# EAGLE design soic8-longpad (EAGLE 7.7.0)
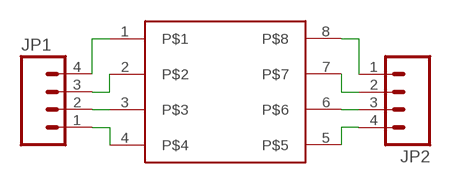
[diagram p0: schematic, sheet 1]

## Parts
JP1  M04NO_SILK_ALL_ROUND  [1X04_NO_SILK_ALL_ROUND]
JP2  M04NO_SILK_ALL_ROUND  [1X04_NO_SILK_ALL_ROUND]
U$1  SOIC8  SOIC8-LONGPAD  [SOIC8-LONGPAD]

## Nets
N$1: JP1.4 U$1.1
N$2: JP1.3 U$1.2
N$3: JP1.2 U$1.3
N$4: JP1.1 U$1.4
N$5: JP2.1 U$1.8
N$6: JP2.2 U$1.7
N$7: JP2.3 U$1.6
N$8: JP2.4 U$1.5

## Library data of the parts
JP1 JP2 = SparkFun-Connectors:M04: Header 4 Standard 4-pin 0.1" header. Use with straight break away headers (SKU : PRT-00116), right angle break away headers (PRT-00553), swiss pins (PRT-00743), machine pins (PRT-00117), and female headers (PRT-00115). Molex polarized connector foot print use with SKU : PRT-08231 with associated crimp pins and housings. 1MM SMD Version SKU: PRT-10208
U$1 = awqua_eagle_library:SOIC8-LONGPAD

## Board
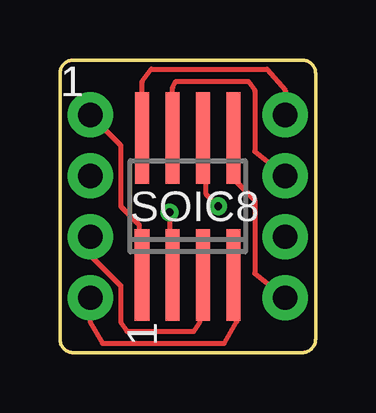
[diagram p1: board, top side]
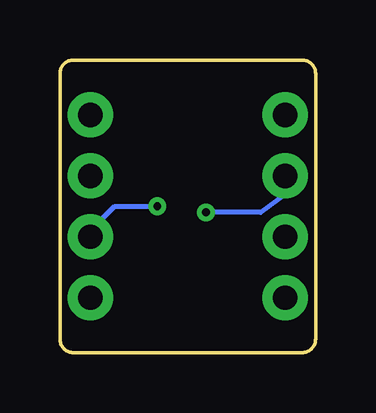
[diagram p2: board, bottom side, seen from below]

Size 10.67 x 12.19 mm. Coordinates in mm from the lower left corner, seen from the top.
Outline: 0,11.62 0,0.57 arc90 0.57,0 10.1,0 arc90 10.67,0.57 10.67,11.62 arc90 10.1,12.19 0.57,12.19 arc90 0,11.62
Copper layers (1*16): Top 0.035mm / dielectric 1.5mm / Bottom 0.035mm
Design rules "default *": minimum track width 10mil, minimum drill 24mil, track to track 8mil, track to pad 8mil, pad to pad 8mil, via to via 8mil, smd to smd 8mil, copper to edge 40mil, drill to drill 8mil, minimum pad ring 10mil, minimum via ring 8mil, stop-mask expansion 4mil, vias tented up to drill 13mil, thermal gap 10mil

### Footprints (pad centres in the part's own frame; a part is rotated, then mirrored left to right if it is on the bottom)
1X04_NO_SILK_ALL_ROUND = drill 1.016 pad 1.88: 1 0,0; 2 2.54,0; 3 5.08,0; 4 7.62,0
SOIC8-LONGPAD = smd 3.81 x 0.635: 1 -0.314,5.715 | smd 3.81 x 0.6: 2 -0.314,4.445; 3 -0.314,3.175; 4 -0.314,1.905; 5 5.394,1.905; 6 5.394,3.175; 7 5.394,4.445; 8 5.394,5.715

### Placement (x,y rotation side)
JP1  1.27,2.29 90 top
JP2  9.4,9.91 270 top
U$1  9.14,3.56 90 top

### Tracks (layer width: path | path; a pad name or v marks a point on that pad's centre or on a via)
N$1
  Top 0.203: JP1.4 2.54,8.64 2.54,6.1 3.3,5.33 3.3,3.37 U$1.1
N$2  (via drill 0.33)
  Top 0.203: v4.57,5.84 4.57,3.37 U$1.2
  Bottom 0.203: JP1.3 1.27,6.6 2.29,5.84 v4.57,5.84
N$3
  Top 0.203: JP1.2 1.27,4.06 2.54,2.79 2.54,1.27 2.79,0.89 5.59,0.89 5.84,1.27 5.84,3.12 U$1.3
N$4
  Top 0.203: JP1.1 1.27,1.27 1.78,0.38 6.86,0.38 7.37,1.27 7.37,3.12 U$1.4
N$5
  Top 0.203: U$1.8 3.43,11.3 3.81,11.81 8.64,11.81 9.4,10.92 JP2.1
N$6
  Top 0.203: U$1.7 4.7,11.05 4.83,11.3 7.87,11.3 8.13,10.92 8.13,8.38 JP2.2
N$7  (via drill 0.33)
  Top 0.203: v6.6,6.1 6.1,6.6 6.1,8.82 U$1.6
  Bottom 0.203: JP2.3 9.4,5.08 8.38,6.1 v6.6,6.1
N$8
  Top 0.203: U$1.5 7.24,7.24 8.13,6.35 8.13,3.3 JP2.4

### Text on the board
tPlace: 1 | 1